# Altium schematic sheet Sheet1.SchDoc
size A4
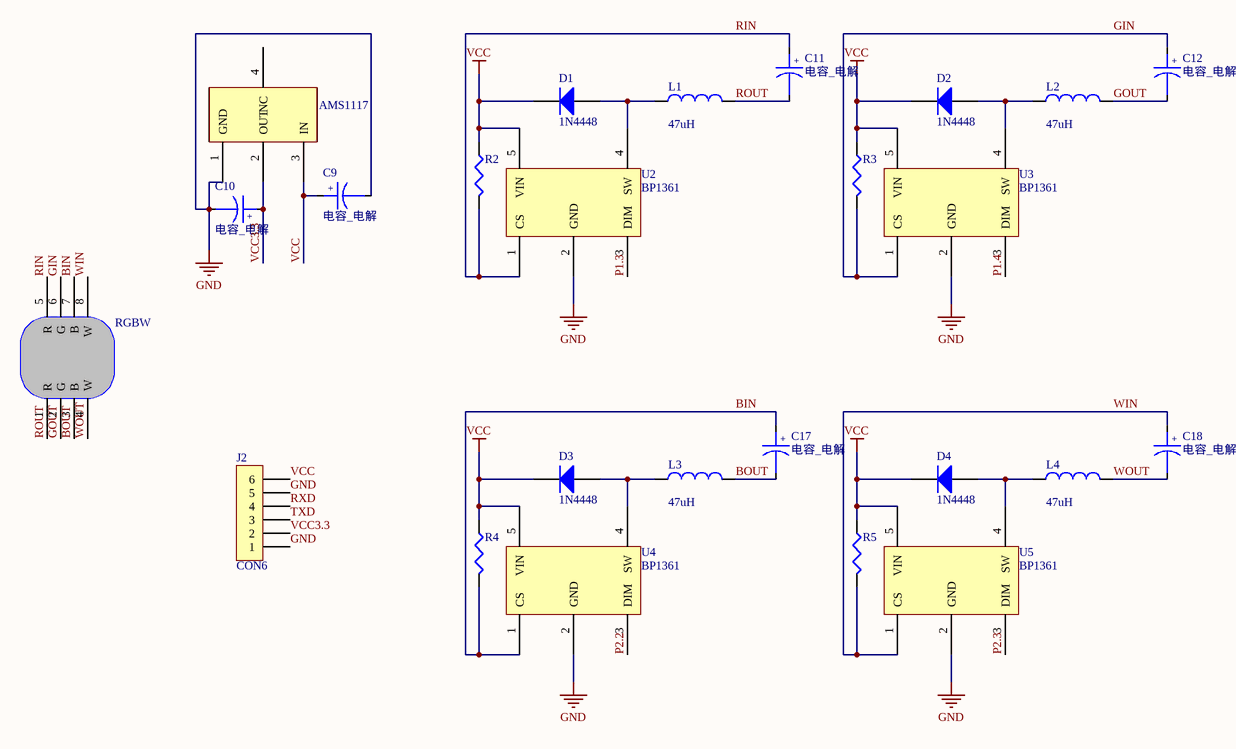
[diagram p0: Sheet1.SchDoc]

## Parts
AMS1117  AMS1117  [SOT223]  (value not drawn)
C9  电容_电解  [10UF]
C10  电容_电解  [10UF]
C11  电容_电解  [10UF]
C12  电容_电解  [10UF]
C17  电容_电解  [10UF]
C18  电容_电解  [10UF]
D1  1N4448  [DO-35]
D2  1N4448  [DO-35]
D3  1N4448  [DO-35]
D4  1N4448  [DO-35]
J2  CON6  [HDR1X6]
L1  value 47uH  [AXIAL0.4_10mm]  (hidden comment: Inductor)
L2  value 47uH  [AXIAL0.4_10mm]  (hidden comment: Inductor)
L3  value 47uH  [AXIAL0.4_10mm]  (hidden comment: Inductor)
L4  value 47uH  [AXIAL0.4_10mm]  (hidden comment: Inductor)
R2  RES  [2512]  (value not drawn)
R3  RES  [2512]  (value not drawn)
R4  RES  [2512]  (value not drawn)
R5  RES  [2512]  (value not drawn)
RGBW  Component_1  [RGBWLED]  (value not drawn)
U2  BP1361  [BSP1361]
U3  BP1361  [BSP1361]
U4  BP1361  [BSP1361]
U5  BP1361  [BSP1361]

## Nets
GND: AMS1117.1(GND) C9.2 C10.2 J2.1 J2.5 U2.2(GND) U3.2(GND) U4.2(GND) U5.2(GND)
VCC: AMS1117.3(IN) C9.1 D1.2(K) D2.2(K) D3.2(K) D4.2(K) J2.6 R2.2(BOT) R3.2(BOT) R4.2(BOT) R5.2(BOT) U2.5(VIN) U3.5(VIN) U4.5(VIN) U5.5(VIN)
BIN: C17.1 R4.1(TOP) RGBW.7(B) U4.1(CS)
BOUT: C17.2 L3.2 RGBW.3(B)
GIN: C12.1 R3.1(TOP) RGBW.6(G) U3.1(CS)
GOUT: C12.2 L2.2 RGBW.2(G)
P1.3: U2.3(DIM)
P1.4: U3.3(DIM)
P2.2: U4.3(DIM)
P2.3: U5.3(DIM)
RIN: C11.1 R2.1(TOP) RGBW.5(R) U2.1(CS)
ROUT: C11.2 L1.2 RGBW.1(R)
RXD: J2.4
TXD: J2.3
VCC3.3: AMS1117.2(OUT) C10.1 J2.2
WIN: C18.1 R5.1(TOP) RGBW.8(W) U5.1(CS)
WOUT: C18.2 L4.2 RGBW.4(W)
NetD1_1: D1.1(A) L1.1 U2.4(SW)
NetD2_1: D2.1(A) L2.1 U3.4(SW)
NetD3_1: D3.1(A) L3.1 U4.4(SW)
NetD4_1: D4.1(A) L4.1 U5.4(SW)

Not connected (* = marked no-connect by the designer): AMS1117 4(NC)

## Notes on the sheet
- (in symbol 电容_电解) +

## Library data of the parts
AMS1117 U2-U5 = Component_1
C9-C12 C17 C18 = 电容_电解: Capacitor
D1-D4 = Diode 1N4448: High Conductance Fast Diode; Published: 8-Jun-2000; LatestRevisionDate: 17-Jul-2002; LatestRevisionNote: Re-released for DXP Platform.; DatasheetVersion: 1997; PackageReference: DO-35; Publisher: Altium Limited; PackageDescription: Diode, Axial; Body 3.8 x 1.9 mm (LxDia. max), Lead Dia. 0.53 mm (max); Code_JEDEC: DO-204-AH; ComponentLink1Description: Manufacturer Link; ComponentLink1URL: http://www.fairchildsemi.com/; ComponentLink2Description: Datasheet; ComponentLink2URL: http://www.fairchildsemi.com/ds/1N%2F1N4448.pdf
J2 = CON6: Connector
L1-L4 = Inductor: Code_IEC: 1005; Published: 8-Jun-2000; LatestRevisionDate: 17-Jul-2002; LatestRevisionNote: Re-released for DXP Platform.; PackageReference: 0402-A; Publisher: Altium Limited; Code_JEITA: 0402
R2-R5 = RES: Resistor